# Altium schematic sheet Board.SchDoc: =ProjectTitle
size 594 x 420 mm; Address1: Address1; Address2: Address2; Address3: Address3; Address4: Address4; SheetNumber: 1; SheetTotal: 9; Scale: 1:1; DocumentType: Схема электрическая принципиальная
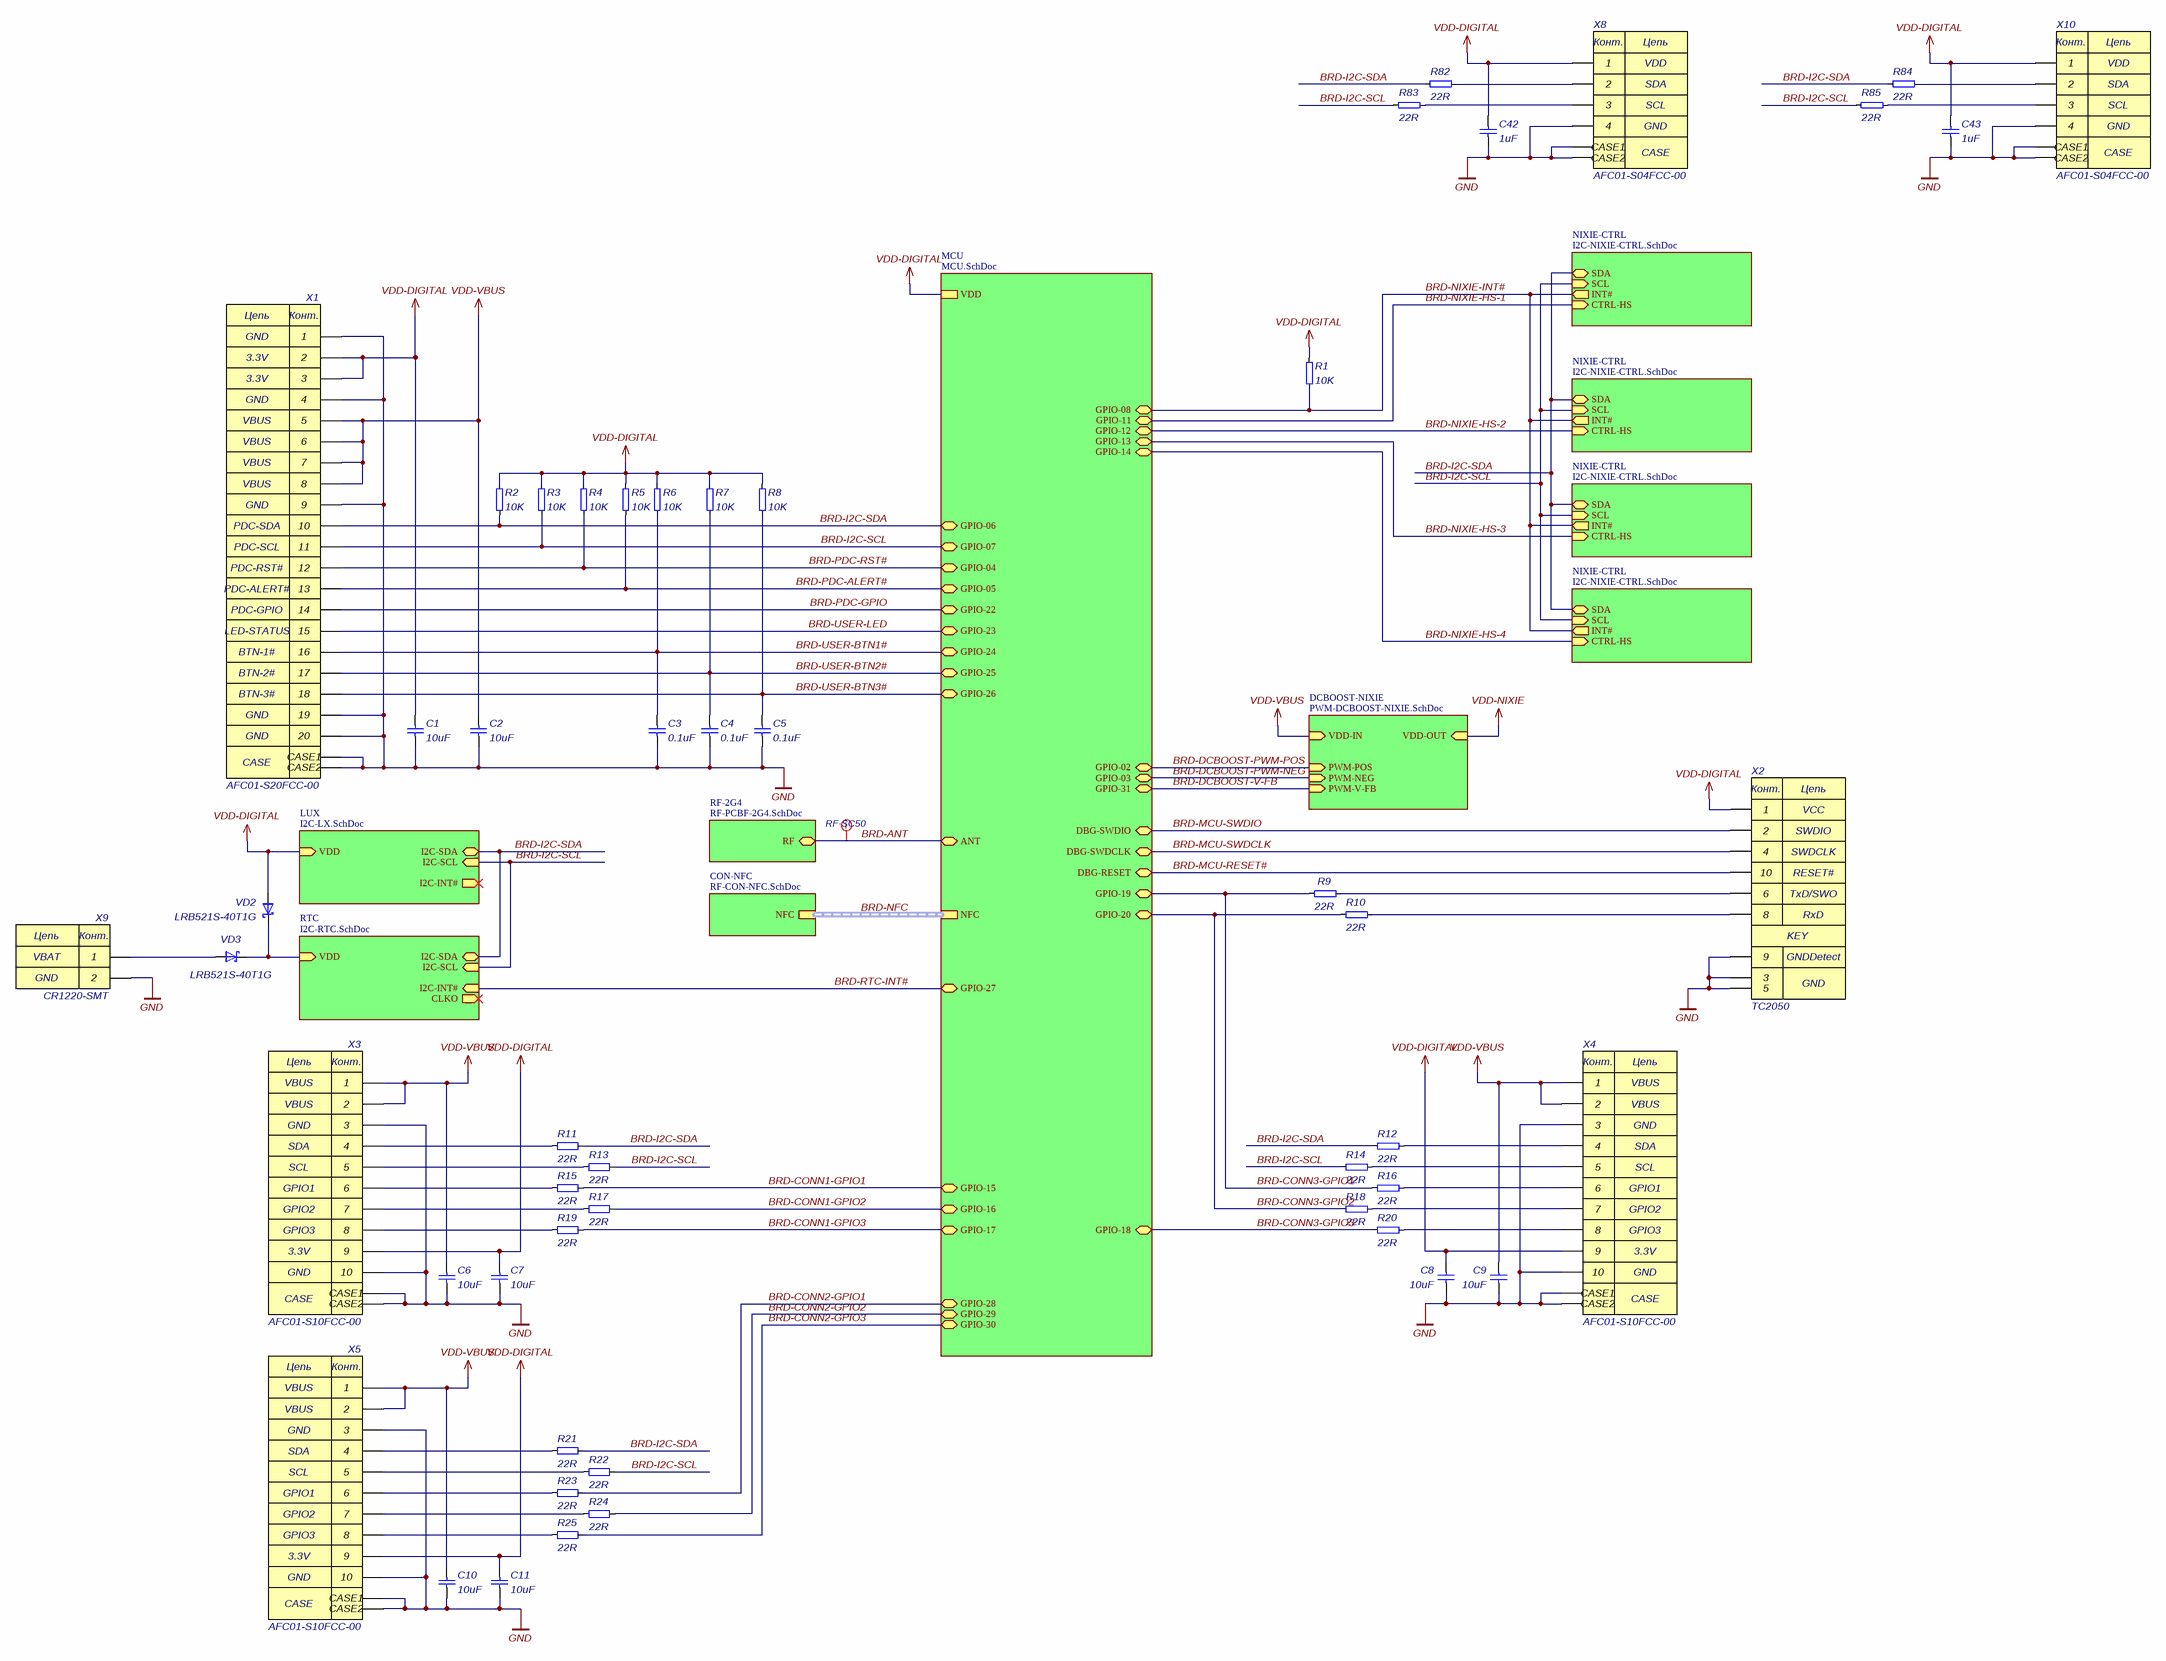
[diagram p0: Board.SchDoc]

## Parts
C1  10uF  [C0805]
C2  10uF  [C0805]
C3  0.1uF  [C0402]
C4  0.1uF  [C0402]
C5  0.1uF  [C0402]
C6  10uF  [C0805]
C7  10uF  [C0805]
C8  10uF  [C0805]
C9  10uF  [C0805]
C10  10uF  [C0805]
C11  10uF  [C0805]
C42  1uF  [C0402]
C43  1uF  [C0402]
R1  10K  [R_0402]
R2  10K  [R_0402]
R3  10K  [R_0402]
R4  10K  [R_0402]
R5  10K  [R_0402]
R6  10K  [R_0402]
R7  10K  [R_0402]
R8  10K  [R_0402]
R9  22R  [R_0402]
R10  22R  [R_0402]
R11  22R  [R_0402]
R12  22R  [R_0402]
R13  22R  [R_0402]
R14  22R  [R_0402]
R15  22R  [R_0402]
R16  22R  [R_0402]
R17  22R  [R_0402]
R18  22R  [R_0402]
R19  22R  [R_0402]
R20  22R  [R_0402]
R21  22R  [R_0402]
R22  22R  [R_0402]
R23  22R  [R_0402]
R24  22R  [R_0402]
R25  22R  [R_0402]
R82  22R  [R_0402]
R83  22R  [R_0402]
R84  22R  [R_0402]
R85  22R  [R_0402]
VD2  LRB521S-40T1G  [SOD-523]
VD3  LRB521S-40T1G  [SOD-523]
X1  AFC01-S20FCC-00  [505110-2096]
X2  TC2050  [TC2050-IDC-FP]  (no BOM)
X3  AFC01-S10FCC-00  [505110-1096]
X4  AFC01-S10FCC-00  [505110-1096]
X5  AFC01-S10FCC-00  [505110-1096]
X8  AFC01-S04FCC-00  [505110-0492]
X9  CR1220-SMT  [BAT-HLDR-CR1220-SMT]
X10  AFC01-S04FCC-00  [505110-0492]

## Sub-sheets
CON-NFC = RF-CON-NFC.SchDoc: NFC (harness NFC)
DCBOOST-NIXIE = PWM-DCBOOST-NIXIE.SchDoc: VDD-IN (in), PWM-POS (in), PWM-NEG (in), VDD-OUT (in), PWM-V-FB (in)
LUX = I2C-LX.SchDoc: I2C-SDA (bidir), I2C-SCL (in), VDD (in), I2C-INT# (out)
MCU = MCU.SchDoc: VDD, NFC (harness NFC), ANT (bidir), GPIO-06 (bidir), GPIO-07 (bidir), GPIO-08 (bidir), GPIO-11 (bidir), GPIO-04 (bidir), GPIO-05 (bidir), GPIO-22 (bidir), GPIO-23 (bidir), GPIO-24 (bidir), GPIO-25 (bidir), GPIO-26 (bidir), GPIO-02 (bidir), GPIO-03 (bidir), GPIO-31 (bidir), GPIO-27 (bidir), GPIO-12 (bidir), GPIO-13 (bidir), GPIO-14 (bidir), GPIO-15 (bidir), GPIO-16 (bidir), GPIO-17 (bidir), GPIO-18 (bidir), GPIO-28 (bidir), GPIO-29 (bidir), GPIO-30 (bidir), DBG-SWDIO (bidir), DBG-SWDCLK (bidir), DBG-RESET (bidir), GPIO-19 (bidir), GPIO-20 (bidir)
NIXIE-CTRL = I2C-NIXIE-CTRL.SchDoc: INT# (out), SDA (bidir), SCL (in), CTRL-HS (in)
NIXIE-CTRL = I2C-NIXIE-CTRL.SchDoc: INT# (out), SDA (bidir), SCL (in), CTRL-HS (in)
NIXIE-CTRL = I2C-NIXIE-CTRL.SchDoc: INT# (out), SDA (bidir), SCL (in), CTRL-HS (in)
NIXIE-CTRL = I2C-NIXIE-CTRL.SchDoc: INT# (out), SDA (bidir), SCL (in), CTRL-HS (in)
RF-2G4 = RF-PCBF-2G4.SchDoc: RF (bidir)
RTC = I2C-RTC.SchDoc: I2C-SDA (bidir), I2C-SCL (in), VDD (in), I2C-INT# (in), CLKO (out)

## Nets
GND: C1.2 C2.2 C3.1 C4.1 C5.1 C6.2 C7.2 C8.2 C9.2 C10.2 C11.2 C42.1 C43.1 X1.1 X1.4 X1.9 X1.19 X1.20 X1.CASE1 X1.CASE2 X2.3 X2.5 X2.9 X3.3 X3.10 X3.CASE1 X3.CASE2 X4.3 X4.10 X4.CASE1 X4.CASE2 X5.3 X5.10 X5.CASE1 X5.CASE2 X8.4 X8.CASE1 X8.CASE2 X9.2 X10.4 X10.CASE1 X10.CASE2
VDD-DIGITAL: C1.1 C7.1 C8.1 C11.1 C42.2 C43.2 R1.1 R2.1 R3.1 R4.1 R5.1 R6.1 R7.1 R8.1 VD2.2(A) X1.2 X1.3 X2.1 X3.9 X4.9 X5.9 X8.1 X10.1 ; sheet MCU/VDD, sheet LUX/VDD
VDD-NIXIE: sheet DCBOOST-NIXIE/VDD-OUT
VDD-VBUS: C2.1 C6.1 C9.1 C10.1 X1.5 X1.6 X1.7 X1.8 X3.1 X3.2 X4.1 X4.2 X5.1 X5.2 ; sheet DCBOOST-NIXIE/VDD-IN
BRD-ANT: sheet MCU/ANT, sheet RF-2G4/RF
BRD-CONN1-GPIO1: R15.2 ; sheet MCU/GPIO-15
BRD-CONN1-GPIO2: R17.2 ; sheet MCU/GPIO-16
BRD-CONN1-GPIO3: R19.2 ; sheet MCU/GPIO-17
BRD-CONN2-GPIO1: R23.2 ; sheet MCU/GPIO-28
BRD-CONN2-GPIO2: R24.2 ; sheet MCU/GPIO-29
BRD-CONN2-GPIO3: R25.2 ; sheet MCU/GPIO-30
BRD-CONN3-GPIO1: R9.2 R16.2 ; sheet MCU/GPIO-19
BRD-CONN3-GPIO2: R10.2 R18.2 ; sheet MCU/GPIO-20
BRD-CONN3-GPIO3: R20.2 ; sheet MCU/GPIO-18
BRD-DCBOOST-PWM-NEG: sheet MCU/GPIO-03, sheet DCBOOST-NIXIE/PWM-NEG
BRD-DCBOOST-PWM-POS: sheet MCU/GPIO-02, sheet DCBOOST-NIXIE/PWM-POS
BRD-DCBOOST-V-FB: sheet MCU/GPIO-31, sheet DCBOOST-NIXIE/PWM-V-FB
BRD-I2C-SCL: R3.2 R13.2 R14.2 R22.2 R83.2 R85.2 X1.11 ; sheet MCU/GPIO-07, sheet LUX/I2C-SCL, sheet RTC/I2C-SCL, sheet NIXIE-CTRL/SCL, sheet NIXIE-CTRL/SCL, sheet NIXIE-CTRL/SCL, sheet NIXIE-CTRL/SCL
BRD-I2C-SDA: R2.2 R11.2 R12.2 R21.2 R82.2 R84.2 X1.10 ; sheet MCU/GPIO-06, sheet LUX/I2C-SDA, sheet RTC/I2C-SDA, sheet NIXIE-CTRL/SDA, sheet NIXIE-CTRL/SDA, sheet NIXIE-CTRL/SDA, sheet NIXIE-CTRL/SDA
BRD-MCU-RESET#: X2.10 ; sheet MCU/DBG-RESET
BRD-MCU-SWDCLK: X2.4 ; sheet MCU/DBG-SWDCLK
BRD-MCU-SWDIO: X2.2 ; sheet MCU/DBG-SWDIO
BRD-NIXIE-HS-1: sheet MCU/GPIO-11, sheet NIXIE-CTRL/CTRL-HS
BRD-NIXIE-HS-2: sheet MCU/GPIO-12, sheet NIXIE-CTRL/CTRL-HS
BRD-NIXIE-HS-3: sheet MCU/GPIO-13, sheet NIXIE-CTRL/CTRL-HS
BRD-NIXIE-HS-4: sheet MCU/GPIO-14, sheet NIXIE-CTRL/CTRL-HS
BRD-NIXIE-INT#: R1.2 ; sheet MCU/GPIO-08, sheet NIXIE-CTRL/INT#, sheet NIXIE-CTRL/INT#, sheet NIXIE-CTRL/INT#, sheet NIXIE-CTRL/INT#
BRD-PDC-ALERT#: R5.2 X1.13 ; sheet MCU/GPIO-05
BRD-PDC-GPIO: X1.14 ; sheet MCU/GPIO-22
BRD-PDC-RST#: R4.2 X1.12 ; sheet MCU/GPIO-04
BRD-RTC-INT#: sheet MCU/GPIO-27, sheet RTC/I2C-INT#
BRD-USER-BTN1#: C3.2 R6.2 X1.16 ; sheet MCU/GPIO-24
BRD-USER-BTN2#: C4.2 R7.2 X1.17 ; sheet MCU/GPIO-25
BRD-USER-BTN3#: C5.2 R8.2 X1.18 ; sheet MCU/GPIO-26
BRD-USER-LED: X1.15 ; sheet MCU/GPIO-23
NetR9_1: R9.1 X2.6
NetR10_1: R10.1 X2.8
NetR11_1: R11.1 X3.4
NetR12_1: R12.1 X4.4
NetR13_1: R13.1 X3.5
NetR14_1: R14.1 X4.5
NetR15_1: R15.1 X3.6
NetR16_1: R16.1 X4.6
NetR17_1: R17.1 X3.7
NetR18_1: R18.1 X4.7
NetR19_1: R19.1 X3.8
NetR20_1: R20.1 X4.8
NetR21_1: R21.1 X5.4
NetR22_1: R22.1 X5.5
NetR23_1: R23.1 X5.6
NetR24_1: R24.1 X5.7
NetR25_1: R25.1 X5.8
NetR82_1: R82.1 X8.2
NetR83_1: R83.1 X8.3
NetR84_1: R84.1 X10.2
NetR85_1: R85.1 X10.3
NetVD2_1: VD2.1(K) VD3.1(K) ; sheet RTC/VDD
NetVD3_2: VD3.2(A) X9.1

## Buses and harness runs
harness BRD-NFC = sheet CON-NFC/NFC = sheet MCU/NFC

## Layout directives
net class RF-SC50: BRD-ANT

## Notes on the sheet
- VDD
- GND
- SDA
- SCL
- 3.3V
- VBUS
- PDC-SDA
- PDC-SCL
- PDC-RST#
- (near X1) PDC-ALERT#
- PDC-GPIO
- (near X1) LED-STATUS
- BTN-1#
- BTN-2#
- BTN-3#
- VBAT
- GPIO1
- GPIO2
- GPIO3
- Перв. применение
- Справ. №
- Подп. и дата
- Инв. № дубл.
- Взам. инв. №
- File name: =DocumentName
  Variant name (Short): =ProjectVariant ( =ProjectBoardVariant )
  Version on board: =ProjectRevisionCode
- Разраб.
- Изм.
- Лист
- № докум.
- Подп.
- Дата
- Лит.
- Масса
- Масштаб
- Пров.
- Т.контр.
- =ProjectDocumentDescription
- Листов
- Инв. № подл.
- Утв.
- Н.контр.
- Копировал
- Формат А2
- (in symbol AFC01-S04FCC-00) Конт.; Цепь; CASE
- (in symbol AFC01-S10FCC-00) Цепь; Конт.; CASE
- (in symbol AFC01-S20FCC-00) Цепь; Конт.; CASE
- (in symbol L-KLS5-CR1220-02) Цепь; Конт.
- (in symbol PCB-TAGC-10PIN-SWD-UART) Конт.; Цепь; VCC; SWDIO; SWDCLK; RESET#; TxD/SWO; RxD; KEY; GNDDetect; GND

## Library data of the parts
C1 C2 C6-C11 = 0805-X5R-25V-10uF±10%: Manufacturer: Samsung; NameFromManufacturer: CL21A106KAYNNNE; Place: S; Voltage: 25V; Tolerance: 10%; Check: False; Part Number: 0805-X5R-25V-10uF±10%; Value: 10uF; Temperature: -55°C~85°C; ComponentLink2Description: Link to datasheet; ComponentLink1Description: DATASHEET; ComponentLink2URL: https://www.terraelectronica.ru/product/1640984; ComponentLink1URL: Datasheets/capacitors/MLCC-1837944.pdf; Last changed: 27.10.2022
C3-C5 = 0402-X5R-50V-0.1uF±10%: Manufacturer: Yageo; NameFromManufacturer: CC0402KRX5R9BB104; Place: S; Voltage: 50V; Tolerance: 10%; Check: False; Part Number: 0402-X5R-50V-0.1uF±10%; Value: 0.1uF; Temperature: -55°C~85°C; ComponentLink2Description: Link to datasheet; ComponentLink1Description: DATASHEET; ComponentLink2URL: https://www.yageo.com/upload/media/product/productsearch/datasheet/mlcc/UPY-GPHC_X5R_4V-to-50V_26.pdf; ComponentLink1URL: Datasheets/capacitors/UPY-GPHC_X5R_4V-to-50V_26.pdf; Last changed: 27.10.2022
C42 C43 = 0402-X5R-10V-01uF±10%: Manufacturer: Yageo; NameFromManufacturer: CC0402KRX5R6BB105; Place: S; Voltage: 10V; Tolerance: 10%; Check: False; Part Number: 0402-X5R-10V-01uF±10%; Value: 1uF; Temperature: -55°C~85°C; ComponentLink2Description: Link to datasheet; ComponentLink1Description: DATASHEET; ComponentLink2URL: https://ru.mouser.com/ProductDetail/YAGEO/CC0402KRX5R6BB105?qs=%2Fha2pyFadujgDGyIaqGI8b3%252BmgRHwq35%252Bnrnc96EVYSPd2LBZ%2FzpTg%3D%3D; ComponentLink1URL: Datasheets/capacitors/UPY-GPHC_X5R_4V-to-50V_27.pdf; Last changed: 27.10.2022
R1-R8 = 0402-0.0625W-10K-100ppm±1%: NameFromManufacturer: RC0402FR-0710KL; Manufacturer: Yageo; Place: S; Tolerance: 1%; Check: False; Part Number: 0402-0.0625W-10K-100ppm±1%; Value: 10K; Temperature: -55°C~155°C; ComponentLink1Description: DATASHEET; ComponentLink1URL: https://ru.mouser.com/ProductDetail/YAGEO/RC0402FR-0710KL?qs=%2Fha2pyFaduhjtLcYvKXQ8IogF7YwN7YtH%252BOO8ZtEEMnoa4yoWYcwpw%3D%3D; Datasheet: Datasheets/resistors/PYu-RC_Group_51_RoHS_L_11.pdf; Last changed: 27.10.2022
R9-R25 R82-R85 = 0402-0.0625W-22R-100ppm±1%: NameFromManufacturer: RC0402FR-0722RL; Manufacturer: Yageo; Place: S; Tolerance: 1%; Check: False; Part Number: 0402-0.0625W-22R-100ppm±1%; Value: 22R; Temperature: -55°C~155°C; ComponentLink1Description: DATASHEET; ComponentLink1URL: https://www.yageo.com/upload/media/product/productsearch/datasheet/rchip/PYu-RC_Group_51_RoHS_L_11.pdf; Datasheet: Datasheets/resistors/PYu-RC_Group_51_RoHS_L_11.pdf; Last changed: 27.10.2022
VD2 VD3 = LRB521S-40T1G: 40V 300mV 200mA SOD-523 Schottky Barrier Diode; Manufacturer: LRC; Place: T; Analog: NSVRB751S40T1G, 	SDM03U40Q-7; Check: False; Part Number: LRB521S-40T1G; Value: LRB521S-40T1G; Temperature: -55°C~125°C; ComponentLink1Description: DATASHEET; NameFromManufacturer: LRB521S-40T1G; ComponentLink1URL: https://www.lcsc.com/product-detail/Schottky-Barrier-Diodes-SBD_LRC-LRB521S-40T1G_C135802.html; Last changed: 13.03.2024
X1 = AFC01-S20FCC-00: Clamshell -25℃~+85℃ 20P Bottom Contact Surface Mount，Right Angle 0.5mm FFC/FPC Connector; Manufacturer: JUSHUO; Place: T; Check: False; Part Number: AFC01-S20FCC-00; Value: AFC01-S20FCC-00; Temperature: -25°C~85°C; ComponentLink1Description: DATASHEET; NameFromManufacturer: AFC01-S20FCC-00; ComponentLink1URL: https://www.lcsc.com/product-detail/FFC-FPC-Connectors_JUSHUO-AFC01-S20FCC-00_C262274.html; Last changed: 10.03.2024
X2 = PCB-TAGC-10PIN-SWD-UART: TAG Connect 10 pin ARM swd compatilbe with UART; Place: T; Check: False; Part Number: PCB-TAGC-10PIN-SWD-UART; Value: TC2050; ComponentLink1Description: DATASHEET; NameFromManufacturer: *
X3-X5 = AFC01-S10FCC-00: Clamshell -25℃~+85℃ 10P Bottom Contact Surface Mount，Right Angle 0.5mm FFC/FPC Connector; Manufacturer: JUSHUO; Place: T; Check: False; Part Number: AFC01-S10FCC-00; Value: AFC01-S10FCC-00; Temperature: -25°C~85°C; ComponentLink1Description: DATASHEET; NameFromManufacturer: AFC01-S10FCC-00; ComponentLink1URL: https://www.lcsc.com/product-detail/FFC-FPC-Connectors_JUSHUO-AFC01-S10FCC-00_C262266.html; Last changed: 11.03.2024
X8 X10 = AFC01-S04FCC-00: Clamshell 4P Bottom Contact Surface Mount, Right Angle 0.5mm, FFC/FPC Connector; Manufacturer: JUSHUO; Place: T; Check: False; Part Number: AFC01-S04FCC-00; Value: AFC01-S04FCC-00; Temperature: -25°C~85°C; ComponentLink1Description: DATASHEET; NameFromManufacturer: AFC01-S04FCC-00; ComponentLink1URL: https://www.lcsc.com/product-detail/FFC-FPC-Connectors_JUSHUO-AFC01-S04FCC-00_C262260.html; Last changed: 10.03.2024
X9 = L-KLS5-CR1220-02: Battery base -25℃~+85℃ CR1220 SMD Battery Connector; Place: T; Analog: XDCR-1220-006, BS-12-B3AA009; Check: False; Part Number: L-KLS5-CR1220-02; Value: CR1220-SMT; Temperature: -25°C~85°C; ComponentLink1Description: DATASHEET; NameFromManufacturer: L-KLS5-CR1220-02; ComponentLink1URL: https://klsele.com/products/Battery-Connectors-Battery-holders/Coin-Cell-Holders/4669.html; Last changed: 13.03.2024